# Altium schematic sheet 11-LED.schdoc
size A2
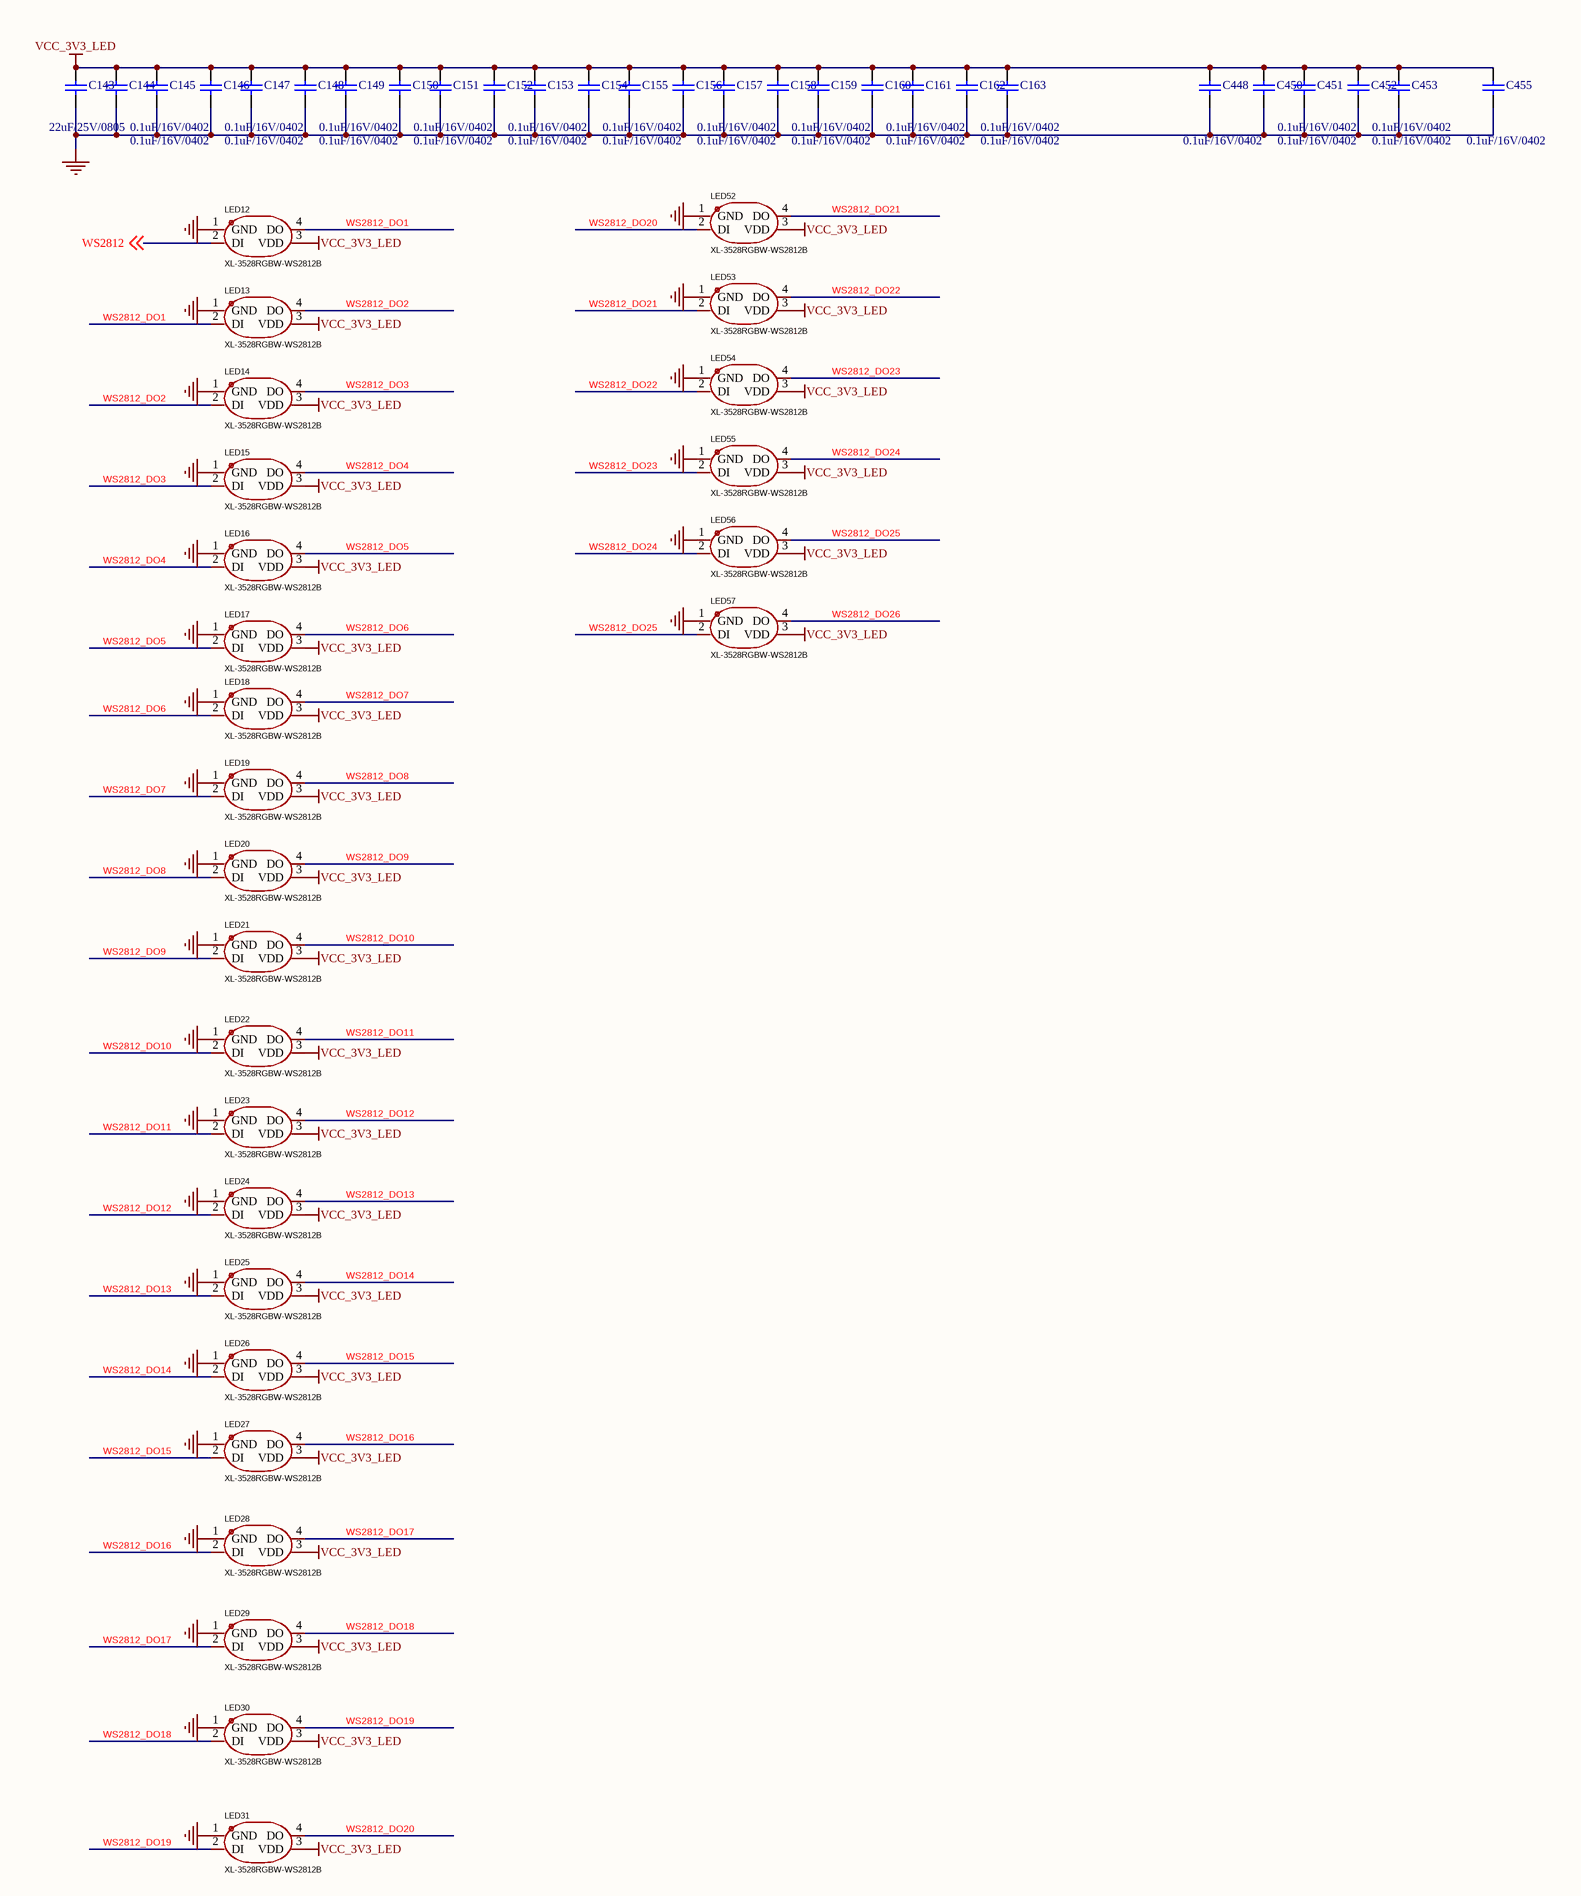
[diagram p0: 11-LED.schdoc]

## Parts
C143  22uF/25V/0805  [C0805]
C144  0.1uF/16V/0402  [C0402]
C145  0.1uF/16V/0402  [C0402]
C146  0.1uF/16V/0402  [C0402]
C147  0.1uF/16V/0402  [C0402]
C148  0.1uF/16V/0402  [C0402]
C149  0.1uF/16V/0402  [C0402]
C150  0.1uF/16V/0402  [C0402]
C151  0.1uF/16V/0402  [C0402]
C152  0.1uF/16V/0402  [C0402]
C153  0.1uF/16V/0402  [C0402]
C154  0.1uF/16V/0402  [C0402]
C155  0.1uF/16V/0402  [C0402]
C156  0.1uF/16V/0402  [C0402]
C157  0.1uF/16V/0402  [C0402]
C158  0.1uF/16V/0402  [C0402]
C159  0.1uF/16V/0402  [C0402]
C160  0.1uF/16V/0402  [C0402]
C161  0.1uF/16V/0402  [C0402]
C162  0.1uF/16V/0402  [C0402]
C163  0.1uF/16V/0402  [C0402]
C448  0.1uF/16V/0402  [C0402]
C450  0.1uF/16V/0402  [C0402]
C451  0.1uF/16V/0402  [C0402]
C452  0.1uF/16V/0402  [C0402]
C453  0.1uF/16V/0402  [C0402]
C455  0.1uF/16V/0402  [C0402]
LED12  XL-3528RGBW-WS2812B  [LED-SMD_4P-L3.5-W2.8-BR-1]
LED13  XL-3528RGBW-WS2812B  [LED-SMD_4P-L3.5-W2.8-BR-1]
LED14  XL-3528RGBW-WS2812B  [LED-SMD_4P-L3.5-W2.8-BR-1]
LED15  XL-3528RGBW-WS2812B  [LED-SMD_4P-L3.5-W2.8-BR-1]
LED16  XL-3528RGBW-WS2812B  [LED-SMD_4P-L3.5-W2.8-BR-1]
LED17  XL-3528RGBW-WS2812B  [LED-SMD_4P-L3.5-W2.8-BR-1]
LED18  XL-3528RGBW-WS2812B  [LED-SMD_4P-L3.5-W2.8-BR-1]
LED19  XL-3528RGBW-WS2812B  [LED-SMD_4P-L3.5-W2.8-BR-1]
LED20  XL-3528RGBW-WS2812B  [LED-SMD_4P-L3.5-W2.8-BR-1]
LED21  XL-3528RGBW-WS2812B  [LED-SMD_4P-L3.5-W2.8-BR-1]
LED22  XL-3528RGBW-WS2812B  [LED-SMD_4P-L3.5-W2.8-BR-1]
LED23  XL-3528RGBW-WS2812B  [LED-SMD_4P-L3.5-W2.8-BR-1]
LED24  XL-3528RGBW-WS2812B  [LED-SMD_4P-L3.5-W2.8-BR-1]
LED25  XL-3528RGBW-WS2812B  [LED-SMD_4P-L3.5-W2.8-BR-1]
LED26  XL-3528RGBW-WS2812B  [LED-SMD_4P-L3.5-W2.8-BR-1]
LED27  XL-3528RGBW-WS2812B  [LED-SMD_4P-L3.5-W2.8-BR-1]
LED28  XL-3528RGBW-WS2812B  [LED-SMD_4P-L3.5-W2.8-BR-1]
LED29  XL-3528RGBW-WS2812B  [LED-SMD_4P-L3.5-W2.8-BR-1]
LED30  XL-3528RGBW-WS2812B  [LED-SMD_4P-L3.5-W2.8-BR-1]
LED31  XL-3528RGBW-WS2812B  [LED-SMD_4P-L3.5-W2.8-BR-1]
LED52  XL-3528RGBW-WS2812B  [LED-SMD_4P-L3.5-W2.8-BR-1]
LED53  XL-3528RGBW-WS2812B  [LED-SMD_4P-L3.5-W2.8-BR-1]
LED54  XL-3528RGBW-WS2812B  [LED-SMD_4P-L3.5-W2.8-BR-1]
LED55  XL-3528RGBW-WS2812B  [LED-SMD_4P-L3.5-W2.8-BR-1]
LED56  XL-3528RGBW-WS2812B  [LED-SMD_4P-L3.5-W2.8-BR-1]
LED57  XL-3528RGBW-WS2812B  [LED-SMD_4P-L3.5-W2.8-BR-1]

## Nets
GND: C143.1 C144.1 C145.1 C146.1 C147.1 C148.1 C149.1 C150.1 C151.1 C152.1 C153.1 C154.1 C155.1 C156.1 C157.1 C158.1 C159.1 C160.1 C161.1 C162.1 C163.1 C448.1 C450.1 C451.1 C452.1 C453.1 C455.1 LED12.1(GND) LED13.1(GND) LED14.1(GND) LED15.1(GND) LED16.1(GND) LED17.1(GND) LED18.1(GND) LED19.1(GND) LED20.1(GND) LED21.1(GND) LED22.1(GND) LED23.1(GND) LED24.1(GND) LED25.1(GND) LED26.1(GND) LED27.1(GND) LED28.1(GND) LED29.1(GND) LED30.1(GND) LED31.1(GND) LED52.1(GND) LED53.1(GND) LED54.1(GND) LED55.1(GND) LED56.1(GND) LED57.1(GND)
VCC_3V3_LED: C143.2 C144.2 C145.2 C146.2 C147.2 C148.2 C149.2 C150.2 C151.2 C152.2 C153.2 C154.2 C155.2 C156.2 C157.2 C158.2 C159.2 C160.2 C161.2 C162.2 C163.2 C448.2 C450.2 C451.2 C452.2 C453.2 C455.2 LED12.3(VDD) LED13.3(VDD) LED14.3(VDD) LED15.3(VDD) LED16.3(VDD) LED17.3(VDD) LED18.3(VDD) LED19.3(VDD) LED20.3(VDD) LED21.3(VDD) LED22.3(VDD) LED23.3(VDD) LED24.3(VDD) LED25.3(VDD) LED26.3(VDD) LED27.3(VDD) LED28.3(VDD) LED29.3(VDD) LED30.3(VDD) LED31.3(VDD) LED52.3(VDD) LED53.3(VDD) LED54.3(VDD) LED55.3(VDD) LED56.3(VDD) LED57.3(VDD)
WS2812: LED12.2(DI) ; off-sheet WS2812
WS2812_DO1: LED12.4(DO) LED13.2(DI)
WS2812_DO2: LED13.4(DO) LED14.2(DI)
WS2812_DO3: LED14.4(DO) LED15.2(DI)
WS2812_DO4: LED15.4(DO) LED16.2(DI)
WS2812_DO5: LED16.4(DO) LED17.2(DI)
WS2812_DO6: LED17.4(DO) LED18.2(DI)
WS2812_DO7: LED18.4(DO) LED19.2(DI)
WS2812_DO8: LED19.4(DO) LED20.2(DI)
WS2812_DO9: LED20.4(DO) LED21.2(DI)
WS2812_DO10: LED21.4(DO) LED22.2(DI)
WS2812_DO11: LED22.4(DO) LED23.2(DI)
WS2812_DO12: LED23.4(DO) LED24.2(DI)
WS2812_DO13: LED24.4(DO) LED25.2(DI)
WS2812_DO14: LED25.4(DO) LED26.2(DI)
WS2812_DO15: LED26.4(DO) LED27.2(DI)
WS2812_DO16: LED27.4(DO) LED28.2(DI)
WS2812_DO17: LED28.4(DO) LED29.2(DI)
WS2812_DO18: LED29.4(DO) LED30.2(DI)
WS2812_DO19: LED30.4(DO) LED31.2(DI)
WS2812_DO20: LED31.4(DO) LED52.2(DI)
WS2812_DO21: LED52.4(DO) LED53.2(DI)
WS2812_DO22: LED53.4(DO) LED54.2(DI)
WS2812_DO23: LED54.4(DO) LED55.2(DI)
WS2812_DO24: LED55.4(DO) LED56.2(DI)
WS2812_DO25: LED56.4(DO) LED57.2(DI)
WS2812_DO26: LED57.4(DO)

## Library data of the parts
C143-C163 C448 C450-C453 C455 = CAP: Capacitor; Value: 100pF; Published: 8-Jun-2000; Revision: July-2002: Re-released for DXP Platform.; Publisher: Altium Limited
LED12-LED31 LED52-LED57 = XL-3528RGBW-WS2812B: Manufacturer: XINGLIGHT(成兴光); Add into BOM: yes; Symbol: XL-3528RGBW-WS2812B; Device: XL-3528RGBW-WS2812B; LCSC Part Name: XL-3528RGBW-WS2812B; Supplier Part: C2890364; Manufacturer Part: XL-3528RGBW-WS2812B; Supplier Footprint: SMD3528-4P; JLCPCB Part Class: Extended Part; Datasheet: https://atta.szlcsc.com/upload/public/pdf/source/20240218/041E1E0D0024617DFFF124D9C311BB4D.pdf; Supplier: LCSC; Convert to PCB: yes; Comment_1: XL-3528RGBW-WS2812B